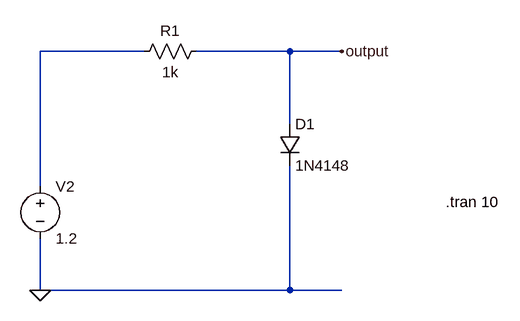
[diagram p0: schematic 2a.asc]
2a.asc, the LTspice schematic file:
Version 4
SHEET 1 1092 680
WIRE 288 112 128 112
WIRE 512 112 368 112
WIRE 592 112 512 112
WIRE 512 224 512 112
WIRE 128 320 128 112
WIRE 128 480 128 400
WIRE 512 480 512 288
WIRE 512 480 128 480
WIRE 592 480 512 480
FLAG 128 480 0
FLAG 592 112 output
SYMBOL voltage 128 304 R0
SYMATTR InstName V2
SYMATTR Value 1.2
SYMBOL diode 496 224 R0
SYMATTR InstName D1
SYMATTR Value 1N4148
SYMBOL res 384 96 R90
WINDOW 0 0 56 VBottom 2
WINDOW 3 32 56 VTop 2
SYMATTR InstName R1
SYMATTR Value 1k
TEXT 752 344 Left 2 !.tran 10

The netlist it stands for:
* 2a.asc
V2 N001 0 1.2
D1 output 0 1N4148
R1 output N001 1k
.model D D
.lib standard.dio
.tran 10
.backanno
.end